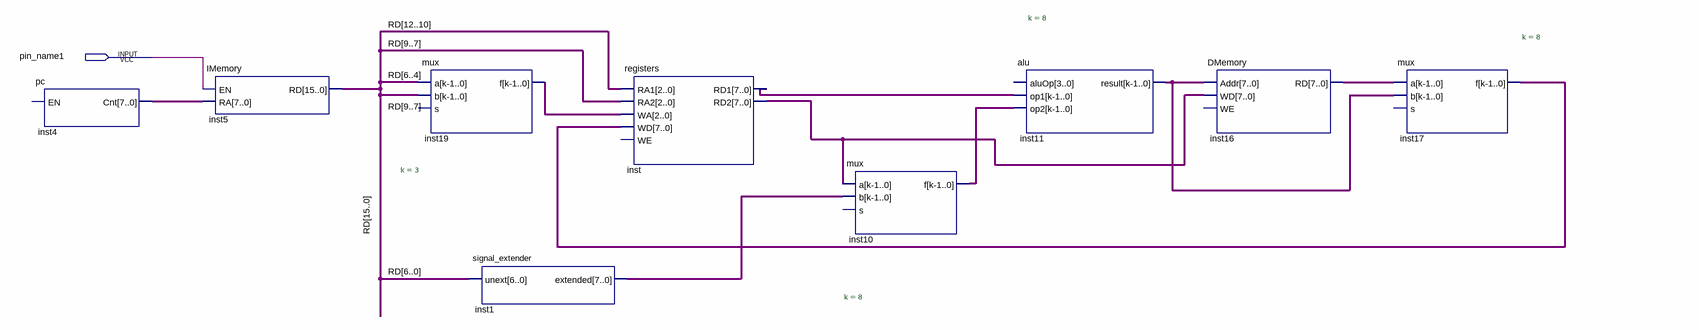
[diagram p0: schematic sheet]
// Quartus schematic micro.bdf as structural Verilog: 9 symbols, 1 pins
module micro (
  input  pin_name1
);

  wire [2:0] inst19_f;
  wire [7:0] inst1_extended, inst4_cnt, inst10_f, inst11_result, inst16_rd, inst17_f, inst_rd1, inst_rd2;
  wire [15:0] RD;

  pc inst4 (.Cnt(inst4_cnt));  // open: EN
  IMemory inst5 (.EN(pin_name1), .RA(inst4_cnt), .RD(RD));
  mux #(.k(3)) inst19 (.a(RD[6:4]), .b(RD[9:7]), .f(inst19_f));  // open: s
  signal_extender inst1 (.unext(RD[6:0]), .extended(inst1_extended));
  registers inst (
    .RA1(RD[12:10]), .RA2(RD[9:7]), .WA(inst19_f), .WD(inst17_f), .RD1(inst_rd1), .RD2(inst_rd2));  // open: WE
  mux #(.k(8)) inst10 (.a(inst_rd2), .b(inst1_extended), .f(inst10_f));  // open: s
  alu #(.k(8)) inst11 (.op1(inst_rd1), .op2(inst10_f), .result(inst11_result));  // open: aluOp
  DMemory inst16 (.Addr(inst11_result), .WD(inst_rd2), .RD(inst16_rd));  // open: WE
  mux #(.k(8)) inst17 (.a(inst16_rd), .b(inst11_result), .f(inst17_f));  // open: s
endmodule
